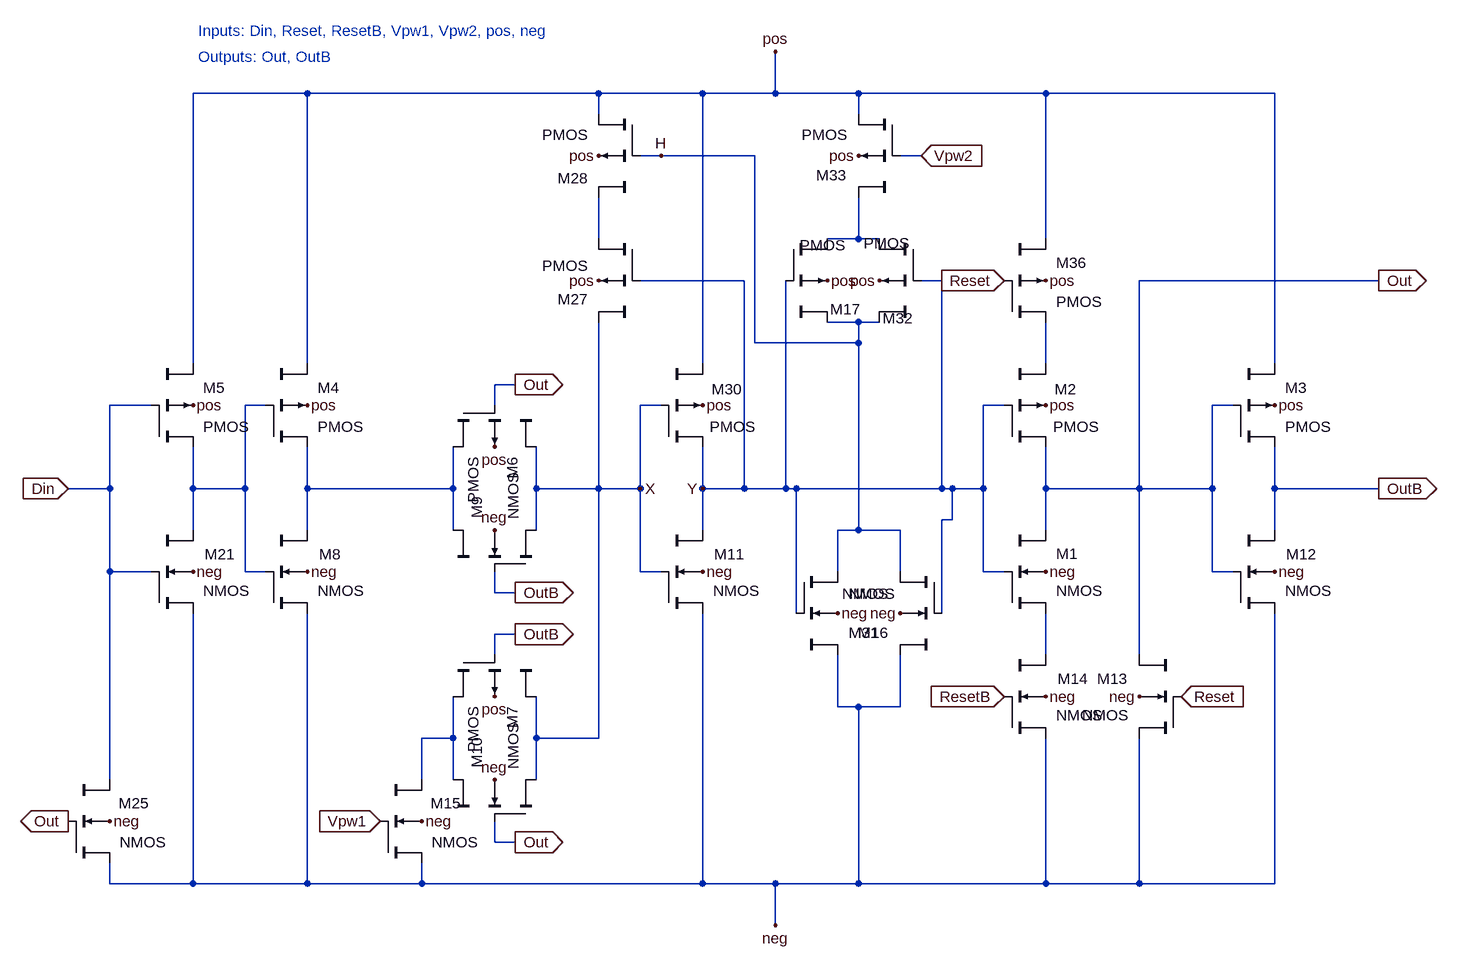
[diagram p0: schematic PulseWidthControl_LDS.asc]
PulseWidthControl_LDS.asc, the LTspice schematic file:
Version 4
SHEET 1 2108 892
WIRE -1888 -512 -2064 -512
WIRE -1440 -512 -1888 -512
WIRE -1280 -512 -1440 -512
WIRE -1168 -512 -1168 -576
WIRE -1168 -512 -1280 -512
WIRE -1040 -512 -1168 -512
WIRE -752 -512 -1040 -512
WIRE -400 -512 -752 -512
WIRE -1440 -480 -1440 -512
WIRE -1040 -480 -1040 -512
WIRE -1344 -416 -1376 -416
WIRE -1200 -416 -1344 -416
WIRE -944 -416 -976 -416
WIRE -1440 -288 -1440 -352
WIRE -1040 -288 -1040 -352
WIRE -1040 -288 -1088 -288
WIRE -1008 -288 -1040 -288
WIRE -752 -288 -752 -512
WIRE -1216 -224 -1376 -224
WIRE -912 -224 -944 -224
WIRE -240 -224 -608 -224
WIRE -1040 -160 -1088 -160
WIRE -1008 -160 -1040 -160
WIRE -1200 -128 -1200 -416
WIRE -1040 -128 -1040 -160
WIRE -1040 -128 -1200 -128
WIRE -2064 -96 -2064 -512
WIRE -1888 -96 -1888 -512
WIRE -1280 -96 -1280 -512
WIRE -752 -96 -752 -160
WIRE -400 -96 -400 -512
WIRE -1568 -64 -1600 -64
WIRE -2128 -32 -2192 -32
WIRE -1952 -32 -1984 -32
WIRE -1600 -32 -1600 -64
WIRE -1344 -32 -1376 -32
WIRE -816 -32 -848 -32
WIRE -464 -32 -496 -32
WIRE -2192 96 -2192 -32
WIRE -2192 96 -2256 96
WIRE -2064 96 -2064 32
WIRE -1984 96 -1984 -32
WIRE -1984 96 -2064 96
WIRE -1888 96 -1888 32
WIRE -1664 96 -1664 32
WIRE -1664 96 -1888 96
WIRE -1536 96 -1536 32
WIRE -1440 96 -1440 -160
WIRE -1440 96 -1536 96
WIRE -1376 96 -1376 -32
WIRE -1376 96 -1440 96
WIRE -1280 96 -1280 32
WIRE -1216 96 -1216 -224
WIRE -1216 96 -1280 96
WIRE -1152 96 -1152 -224
WIRE -1152 96 -1216 96
WIRE -1136 96 -1152 96
WIRE -912 96 -912 -224
WIRE -912 96 -1136 96
WIRE -896 96 -912 96
WIRE -848 96 -848 -32
WIRE -848 96 -896 96
WIRE -752 96 -752 32
WIRE -608 96 -608 -224
WIRE -608 96 -752 96
WIRE -496 96 -496 -32
WIRE -496 96 -608 96
WIRE -400 96 -400 32
WIRE -240 96 -400 96
WIRE -896 144 -896 96
WIRE -896 144 -912 144
WIRE -2064 160 -2064 96
WIRE -1888 160 -1888 96
WIRE -1664 160 -1664 96
WIRE -1536 160 -1536 96
WIRE -1280 160 -1280 96
WIRE -1040 160 -1040 -128
WIRE -1040 160 -1072 160
WIRE -976 160 -1040 160
WIRE -752 160 -752 96
WIRE -400 160 -400 96
WIRE -2192 224 -2192 96
WIRE -2128 224 -2192 224
WIRE -1984 224 -1984 96
WIRE -1952 224 -1984 224
WIRE -1376 224 -1376 96
WIRE -1344 224 -1376 224
WIRE -1072 224 -1072 160
WIRE -976 224 -976 160
WIRE -848 224 -848 96
WIRE -816 224 -848 224
WIRE -496 224 -496 96
WIRE -464 224 -496 224
WIRE -1600 256 -1600 224
WIRE -1568 256 -1600 256
WIRE -1136 288 -1136 96
WIRE -912 288 -912 144
WIRE -1568 320 -1600 320
WIRE -1600 352 -1600 320
WIRE -752 352 -752 288
WIRE -608 352 -608 96
WIRE -1072 432 -1072 352
WIRE -1040 432 -1072 432
WIRE -976 432 -976 352
WIRE -976 432 -1040 432
WIRE -1664 480 -1664 416
WIRE -1664 480 -1712 480
WIRE -1536 480 -1536 416
WIRE -1440 480 -1440 96
WIRE -1440 480 -1536 480
WIRE -2192 544 -2192 224
WIRE -1712 544 -1712 480
WIRE -1664 544 -1664 480
WIRE -1536 544 -1536 480
WIRE -1600 640 -1600 608
WIRE -1568 640 -1600 640
WIRE -2192 704 -2192 672
WIRE -2064 704 -2064 288
WIRE -2064 704 -2192 704
WIRE -1888 704 -1888 288
WIRE -1888 704 -2064 704
WIRE -1712 704 -1712 672
WIRE -1712 704 -1888 704
WIRE -1280 704 -1280 288
WIRE -1280 704 -1712 704
WIRE -1168 704 -1280 704
WIRE -1040 704 -1040 432
WIRE -1040 704 -1168 704
WIRE -752 704 -752 480
WIRE -752 704 -1040 704
WIRE -608 704 -608 480
WIRE -608 704 -752 704
WIRE -400 704 -400 288
WIRE -400 704 -608 704
WIRE -1168 768 -1168 704
FLAG -944 -416 Vpw2
IOPIN -944 -416 In
FLAG -2192 608 neg
FLAG -1712 608 neg
FLAG -1600 544 neg
FLAG -2064 224 neg
FLAG -1888 224 neg
FLAG -1280 224 neg
FLAG -1600 160 neg
FLAG -752 416 neg
FLAG -608 416 neg
FLAG -400 224 neg
FLAG -1072 288 neg
FLAG -1168 -576 pos
FLAG -2064 -32 pos
FLAG -1888 -32 pos
FLAG -1440 -416 pos
FLAG -1440 -224 pos
FLAG -1280 -32 pos
FLAG -1008 -224 pos
FLAG -1040 -416 pos
FLAG -752 -224 pos
FLAG -400 -32 pos
FLAG -1600 416 pos
FLAG -1600 32 pos
FLAG -2256 96 Din
IOPIN -2256 96 In
FLAG -1776 608 Vpw1
IOPIN -1776 608 In
FLAG -240 -224 Out
IOPIN -240 -224 Out
FLAG -1568 -64 Out
IOPIN -1568 -64 Out
FLAG -1568 640 Out
IOPIN -1568 640 Out
FLAG -2256 608 Out
IOPIN -2256 608 Out
FLAG -1568 256 OutB
IOPIN -1568 256 Out
FLAG -1568 320 OutB
IOPIN -1568 320 Out
FLAG -240 96 OutB
IOPIN -240 96 Out
FLAG -544 416 Reset
IOPIN -544 416 In
FLAG -816 -224 Reset
IOPIN -816 -224 In
FLAG -816 416 ResetB
IOPIN -816 416 In
FLAG -1280 96 Y
FLAG -1344 -416 H
FLAG -1376 96 X
FLAG -752 224 neg
FLAG -752 -32 pos
FLAG -1168 768 neg
FLAG -976 288 neg
FLAG -1088 -224 pos
SYMBOL cktsym\\nmos4 -2064 224 R0
WINDOW 3 16 29 Left 2
WINDOW 0 18 -27 Left 2
SYMATTR InstName M21
SYMATTR Value2 l=0.6u w=0.9u
SYMBOL cktsym\\nmos4 -2192 608 R0
WINDOW 3 15 32 Left 2
WINDOW 0 14 -28 Left 2
SYMATTR InstName M25
SYMATTR Value2 l=2.4u w=4.5u
SYMBOL cktsym\\pmos4 -1440 -224 R180
WINDOW 3 16 23 Left 2
WINDOW 0 16 -29 Left 2
SYMATTR InstName M27
SYMATTR Value2 l=0.9u w=1.2u
SYMBOL cktsym\\pmos4 -1440 -416 R180
WINDOW 3 16 32 Left 2
WINDOW 0 16 -35 Left 2
SYMATTR InstName M28
SYMATTR Value2 l=3.6u w=7.2u
SYMBOL cktsym\\pmos4 -1280 -32 R0
WINDOW 3 11 33 Left 2
WINDOW 0 14 -25 Left 2
SYMATTR InstName M30
SYMATTR Value2 l=0.6u w=1.8u
SYMBOL cktsym\\nmos4 -1072 288 M180
WINDOW 3 17 30 Left 2
WINDOW 0 17 -30 Left 2
SYMATTR InstName M31
SYMATTR Value2 l=0.9u w=0.9u
SYMBOL cktsym\\pmos4 -1008 -224 R180
WINDOW 3 -46 57 Left 2
WINDOW 0 -52 -58 Left 2
SYMATTR InstName M32
SYMATTR Value2 l=0.9u w=1.8u
SYMBOL cktsym\\pmos4 -1040 -416 R180
WINDOW 3 17 32 Left 2
WINDOW 0 18 -30 Left 2
SYMATTR InstName M33
SYMATTR Value2 l=1.8u w=4.8u
SYMBOL cktsym\\pmos4 -752 -224 R0
WINDOW 3 16 33 Left 2
WINDOW 0 16 -27 Left 2
SYMATTR InstName M36
SYMATTR Value2 l=0.6u w=1.8u
SYMBOL cktsym\\nmos4 -752 224 R0
WINDOW 3 16 29 Left 2
WINDOW 0 16 -28 Left 2
SYMATTR InstName M1
SYMATTR Value2 l=0.6u w=1.8u
SYMBOL cktsym\\pmos4 -752 -32 R0
WINDOW 3 11 33 Left 2
WINDOW 0 14 -25 Left 2
SYMATTR InstName M2
SYMATTR Value2 l=0.6u w=3.6u
SYMBOL cktsym\\pmos4 -400 -32 R0
WINDOW 3 16 33 Left 2
WINDOW 0 16 -27 Left 2
SYMATTR InstName M3
SYMATTR Value2 l=0.6u w=1.8u
SYMBOL cktsym\\pmos4 -1888 -32 R0
WINDOW 3 16 33 Left 2
WINDOW 0 16 -27 Left 2
SYMATTR InstName M4
SYMATTR Value2 l=0.6u w=1.8u
SYMBOL cktsym\\pmos4 -2064 -32 R0
WINDOW 3 16 33 Left 2
WINDOW 0 16 -27 Left 2
SYMATTR InstName M5
SYMATTR Value2 l=0.6u w=1.8u
SYMBOL cktsym\\pmos4 -1600 32 R90
WINDOW 3 16 33 Left 2
WINDOW 0 16 -27 Left 2
SYMATTR InstName M6
SYMATTR Value2 l=0.6u w=1.8u
SYMBOL cktsym\\pmos4 -1600 416 R90
WINDOW 3 16 33 Left 2
WINDOW 0 16 -27 Left 2
SYMATTR InstName M7
SYMATTR Value2 l=0.6u w=1.8u
SYMBOL cktsym\\nmos4 -1888 224 R0
WINDOW 3 16 29 Left 2
WINDOW 0 18 -27 Left 2
SYMATTR InstName M8
SYMATTR Value2 l=0.6u w=0.9u
SYMBOL cktsym\\nmos4 -1600 160 R270
WINDOW 3 16 29 Left 2
WINDOW 0 18 -27 Left 2
SYMATTR InstName M9
SYMATTR Value2 l=0.6u w=0.9u
SYMBOL cktsym\\nmos4 -1600 544 R270
WINDOW 3 16 29 Left 2
WINDOW 0 18 -27 Left 2
SYMATTR InstName M10
SYMATTR Value2 l=0.6u w=0.9u
SYMBOL cktsym\\nmos4 -1280 224 R0
WINDOW 3 16 29 Left 2
WINDOW 0 18 -27 Left 2
SYMATTR InstName M11
SYMATTR Value2 l=0.6u w=0.9u
SYMBOL cktsym\\nmos4 -400 224 R0
WINDOW 3 16 29 Left 2
WINDOW 0 18 -27 Left 2
SYMATTR InstName M12
SYMATTR Value2 l=0.6u w=0.9u
SYMBOL cktsym\\nmos4 -608 416 M0
WINDOW 3 16 29 Left 2
WINDOW 0 18 -27 Left 2
SYMATTR InstName M13
SYMATTR Value2 l=0.6u w=0.9u
SYMBOL cktsym\\nmos4 -752 416 R0
WINDOW 3 16 29 Left 2
WINDOW 0 18 -27 Left 2
SYMATTR InstName M14
SYMATTR Value2 l=0.6u w=0.9u
SYMBOL cktsym\\nmos4 -1712 608 R0
WINDOW 3 15 32 Left 2
WINDOW 0 14 -28 Left 2
SYMATTR InstName M15
SYMATTR Value2 l=2.4u w=4.5u
SYMBOL cktsym\\nmos4 -976 288 R180
WINDOW 3 17 30 Left 2
WINDOW 0 17 -30 Left 2
SYMATTR InstName M16
SYMATTR Value2 l=0.9u w=0.9u
SYMBOL cktsym\\pmos4 -1088 -224 M180
WINDOW 3 -43 54 Left 2
WINDOW 0 4 -44 Left 2
SYMATTR InstName M17
SYMATTR Value2 l=0.9u w=1.8u
TEXT -2056 -608 Left 2 ;Inputs: Din, Reset, ResetB, Vpw1, Vpw2, pos, neg
TEXT -2056 -568 Left 2 ;Outputs: Out, OutB

The netlist it stands for:
* PulseWidthControl_LDS.asc
M21 N004 Din neg neg NMOS l=0.6u w=0.9u
M25 Din Out neg neg NMOS l=2.4u w=4.5u
M27 N001 Y X pos PMOS l=0.9u w=1.2u
M28 pos H N001 pos PMOS l=3.6u w=7.2u
M30 Y X pos pos PMOS l=0.6u w=1.8u
M31 neg Y H neg NMOS l=0.9u w=0.9u
M32 N002 Y H pos PMOS l=0.9u w=1.8u
M33 pos Vpw2 N002 pos PMOS l=1.8u w=4.8u
M36 N003 Reset pos pos PMOS l=0.6u w=1.8u
M1 Out Y N006 neg NMOS l=0.6u w=1.8u
M2 Out Y N003 pos PMOS l=0.6u w=3.6u
M3 OutB Out pos pos PMOS l=0.6u w=1.8u
M4 N005 N004 pos pos PMOS l=0.6u w=1.8u
M5 N004 Din pos pos PMOS l=0.6u w=1.8u
M6 N005 Out X pos PMOS l=0.6u w=1.8u
M7 N007 OutB X pos PMOS l=0.6u w=1.8u
M8 N005 N004 neg neg NMOS l=0.6u w=0.9u
M9 N005 OutB X neg NMOS l=0.6u w=0.9u
M10 N007 Out X neg NMOS l=0.6u w=0.9u
M11 Y X neg neg NMOS l=0.6u w=0.9u
M12 OutB Out neg neg NMOS l=0.6u w=0.9u
M13 Out Reset neg neg NMOS l=0.6u w=0.9u
M14 N006 ResetB neg neg NMOS l=0.6u w=0.9u
M15 N007 Vpw1 neg neg NMOS l=2.4u w=4.5u
M16 neg Y H neg NMOS l=0.9u w=0.9u
M17 N002 Y H pos PMOS l=0.9u w=1.8u
.model NMOS NMOS
.model PMOS PMOS
.lib standard.mos
* Inputs: Din, Reset, ResetB, Vpw1, Vpw2, pos, neg
* Outputs: Out, OutB
.backanno
.end